# EAGLE design Escorna_Shield_botoneira_2_0D (EAGLE 6.4)
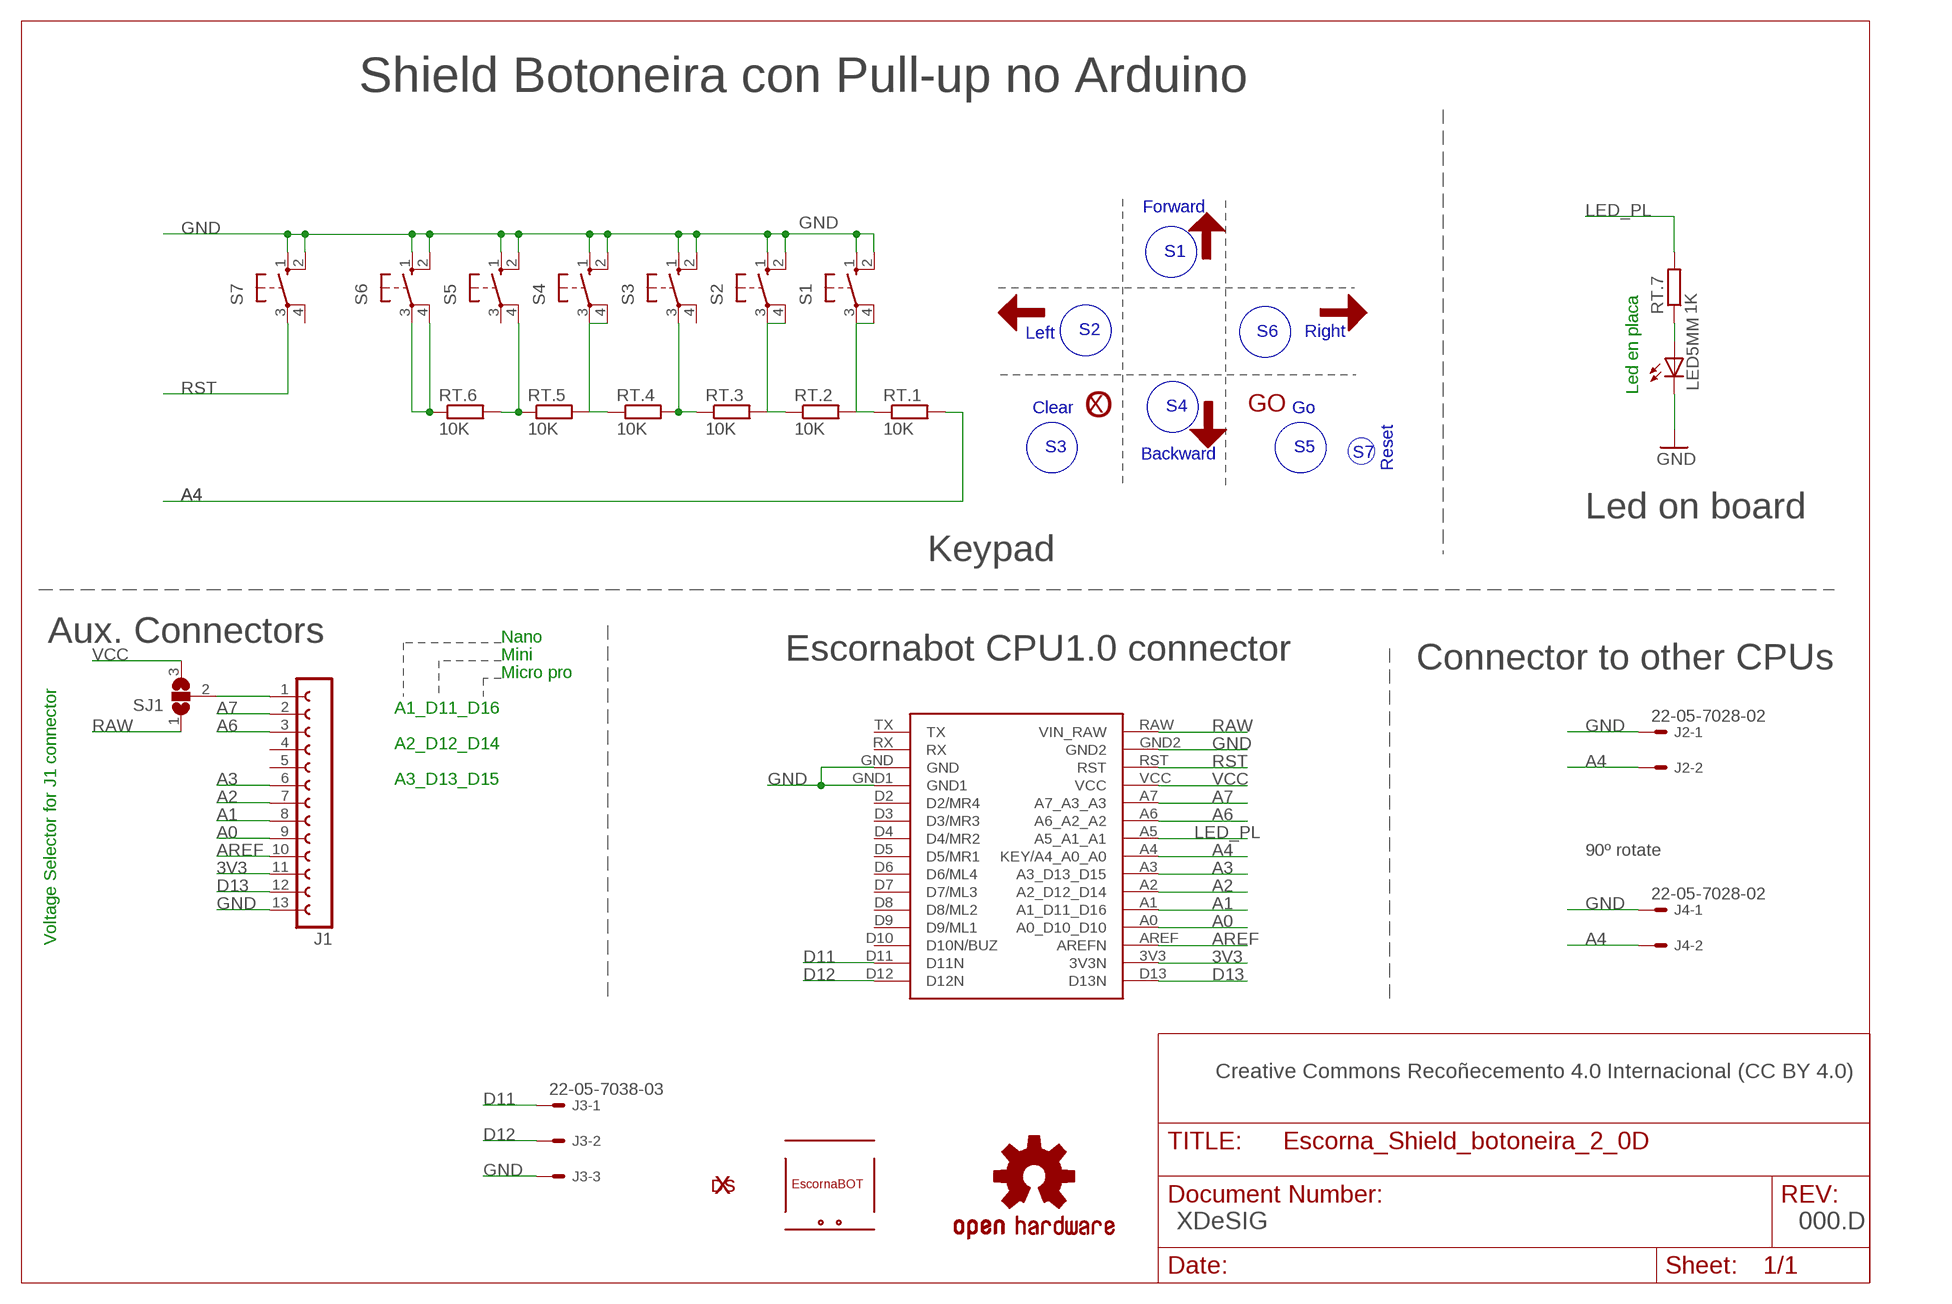
[diagram p0: schematic, sheet 1]

## Parts
ESSH1  OUTL_ESCORNASHILED  [OUTL_ESCORNASHIELD]
J1  FE13-1  [FE13]
J2  22-05-7028-02  [7395-02]
J3  22-05-7038-03  [7395-03]
J4  22-05-7028-02  [7395-02]
LED5MM  LED5MM  [LED5MM]
LOGO2  OSHW-LOGOS  [OSHW-LOGO-S]
RT.1  10K  R-EU_0204/7  [0204/7]
RT.2  10K  R-EU_0204/7  [0204/7]
RT.3  10K  R-EU_0204/7  [0204/7]
RT.4  10K  R-EU_0204/7  [0204/7]
RT.5  10K  R-EU_0204/7  [0204/7]
RT.6  10K  R-EU_0204/7  [0204/7]
RT.7  1K  R-EU_0204/7  [0204/7]
S1  B3F-40XX  40-XX  [B3F40XX_NH]
S2  B3F-40XX  40-XX  [B3F40XX_NH]
S3  B3F-40XX  40-XX  [B3F40XX_NH]
S4  B3F-40XX  40-XX  [B3F40XX_NH]
S5  B3F-40XX  40-XX  [B3F40XX_NH]
S6  B3F-40XX  40-XX  [B3F40XX_NH]
S7  10-XX  [B3F-10XX]
SJ1  SOLDERJUMPER_2WAY  [SJ_2]
U$1  ESCORNABOT  [ESCORNA_PEQUE]
U$3  XDESIG21  [XDESIG]
U$4  FRECHA  [FRECHA]
U$5  FRECHA  [FRECHA]
U$6  FRECHA  [FRECHA]
U$7  FRECHA  [FRECHA]
U$8  GO  [VALE]
U$9  CANCELA  [ASPA]
U$10  XDESIG  [XDESIG_CU_2]

## Nets
3V3: ESSH1.3V3(3V3N) J1.11
A0: ESSH1.A0(A0_D10_D10) J1.9
A1: ESSH1.A1(A1_D11_D16) J1.8
A2: ESSH1.A2(A2_D12_D14) J1.7
A3: ESSH1.A3(A3_D13_D15) J1.6
A4: ESSH1.A4(KEY/A4_A0_A0) J2.2 J4.2 RT.1.2
A6: ESSH1.A6(A6_A2_A2) J1.3
A7: ESSH1.A7(A7_A3_A3) J1.2
AREF: ESSH1.AREF(AREFN) J1.10
D11: ESSH1.D11(D11N) J3.1
D12: ESSH1.D12(D12N) J3.2
D13: ESSH1.D13(D13N) J1.12
GND: ESSH1.GND ESSH1.GND1 ESSH1.GND2 J1.13 J2.1 J3.3 J4.1 LED5MM.K(C) S1.1(S) S1.2(S1) S2.1(S) S2.2(S1) S3.1(S) S3.2(S1) S4.1(S) S4.2(S1) S5.1(S) S5.2(S1) S6.1(S) S6.2(S1) S7.1(S) S7.2(S1)
LED_PL: ESSH1.A5(A5_A1_A1) RT.7.2
N$1: LED5MM.A RT.7.1
N$2: J1.1 SJ1.2
N$3: RT.2.2 S1.4(P1)
N$4: RT.1.1 S1.3(P)
N$5: RT.5.2 S4.4(P1)
N$6: RT.6.1 S6.3(P) S6.4(P1)
N$7: RT.4.1 S4.3(P)
N$8: RT.3.1 RT.4.2 S3.3(P)
N$9: RT.2.1 S2.3(P)
N$10: RT.3.2 S2.4(P1)
N$13: RT.5.1 RT.6.2 S5.4(P1)
RAW: ESSH1.RAW(VIN_RAW) SJ1.1
RST: ESSH1.RST S7.3(P)
VCC: ESSH1.VCC SJ1.3
Unconnected: ESSH1.D2(D2/MR4) ESSH1.D3(D3/MR3) ESSH1.D4(D4/MR2) ESSH1.D5(D5/MR1) ESSH1.D6(D6/ML4) ESSH1.D7(D7/ML3) ESSH1.D8(D8/ML2) ESSH1.D9(D9/ML1) ESSH1.D10(D10N/BUZ) ESSH1.RX ESSH1.TX J1.4 J1.5 S3.4(P1) S5.3(P) S7.4(P1)

## Notes on the sheet
- Shield Botoneira con Pull-up no Arduino
- Forward
- S1
- Left | S2 | S6 | Right
- Led en placa
- Clear | S4 | Go
- S3 | S5
- Backward | S7
- Reset
- Led on board
- Keypad
- Aux. Connectors | Nano | Connector to other CPUs
- Mini | Escornabot CPU1.0 connector
- Micro pro
- A1_D11_D16
- A2_D12_D14
- A3_D13_D15
- 90º rotate
- Voltage Selector for J1 connector
- Creative Commons Recoñecemento 4.0 Internacional (CC BY 4.0)
- XDeSIG | 000.D

## Library data of the parts
ESSH1 = escorna:OUTL_ESCORNASHILED
J1 = con-lsta:FE13-1: FEMALE HEADER; OC_FARNELL: unknown; OC_NEWARK: unknown
J2 J4 = con-molex:22-?-02: CONNECTOR wire to board 2.54 mm (.1 inch) pitch header; OC_FARNELL: 9731601; OC_NEWARK: unknown
J3 = con-molex:22-?-03: CONNECTOR wire to board 2.54 mm (.1 inch) pitch header; OC_FARNELL: unknown; OC_NEWARK: unknown
LED5MM = adafruit:LED: LED OSRAM: - CHIPLED LG R971, LG N971, LY N971, LG Q971, LY Q971, LO R971, LY R971 LH N974, LH R974 LS Q976, LO Q976, LY Q976 LO Q996 - Hyper CHIPLED LW Q18S LB Q993, LB Q99A, LB R99A - SideLED LS A670, LO A670, LY A670, LG A670, LP A670 LB A673, LV A673, LT A673, LW A673 LH A674 LY A675 LS A676, LA A676, LO A676, LY A676, LW A676 LS A679, LY A679, LG A679 - Hyper Micro SIDELED® LS Y876, LA Y876, LO Y876, LY Y876 LT Y87S - SmartLED LW L88C, LW L88S LB L89C, LB L89S, LG L890 LS L89K, LO L89K, LY L89K LS L896, LA L896, LO L896, LY L896 - TOPLED LS T670, LO T670, LY T670, LG T670, LP T670 LSG T670, LSP T670, LSY T670, LOP T670, LYG T670 LG T671, LOG T671, LSG T671 LB T673, LV T673, LT T673, LW T673 LH T674 LS T676, LA T676, LO T676, LY T676, LB T676, LH T676, LSB T676, LW T676 LB T67C, LV T67C, LT T67C, LS T67K, LO T67K, LY T67K, LW E67C LS E67B, LA E67B, LO E67B, LY E67B, LB E67C, LV E67C, LT E67C LW T67C LS T679, LY T679, LG T679 LS T770, LO T770, LY T770, LG T770, LP T770 LB T773, LV T773, LT T773, LW T773 LH T774 LS E675, LA E675, LY E675, LS T675 LS T776, LA T776, LO T776, LY T776, LB T776 LHGB T686 LT T68C, LB T68C - Hyper Mini TOPLED® LB M676 - Mini TOPLED Santana® LG M470 LS M47K, LO M47K, LY M47K Source: http://www.osram.convergy.de/
LOGO2 = SparkFun-Aesthetics:OSHW-LOGO: Open Source Hardware Logo This logo indicates the piece of hardware it is found on incorporates a OSHW license and/or adheres to the definition of open source hardware found here: http://freedomdefined.org/OSHW
RT.1-RT.7 = rcl:R-EU_: RESISTOR, European symbol
S1-S6 = switch-omron:40-XX: OMRON SWITCH
S7 = switch-omron:10-XX: OMRON SWITCH; MPN: B3F-1000; OC_FARNELL: 176432; OC_NEWARK: 36M3542
SJ1 = SparkFunEagle-6-6-07:SOLDERJUMPER_2WAY: Solder Jumper 2 way solder jumper
U$1 = escorna:ESCORNABOT
U$3 U$10 = xdesig:XDESIG
U$4-U$7 = escorna:FRECHA
U$8 = escorna:GO
U$9 = escorna:CANCELA

## Board
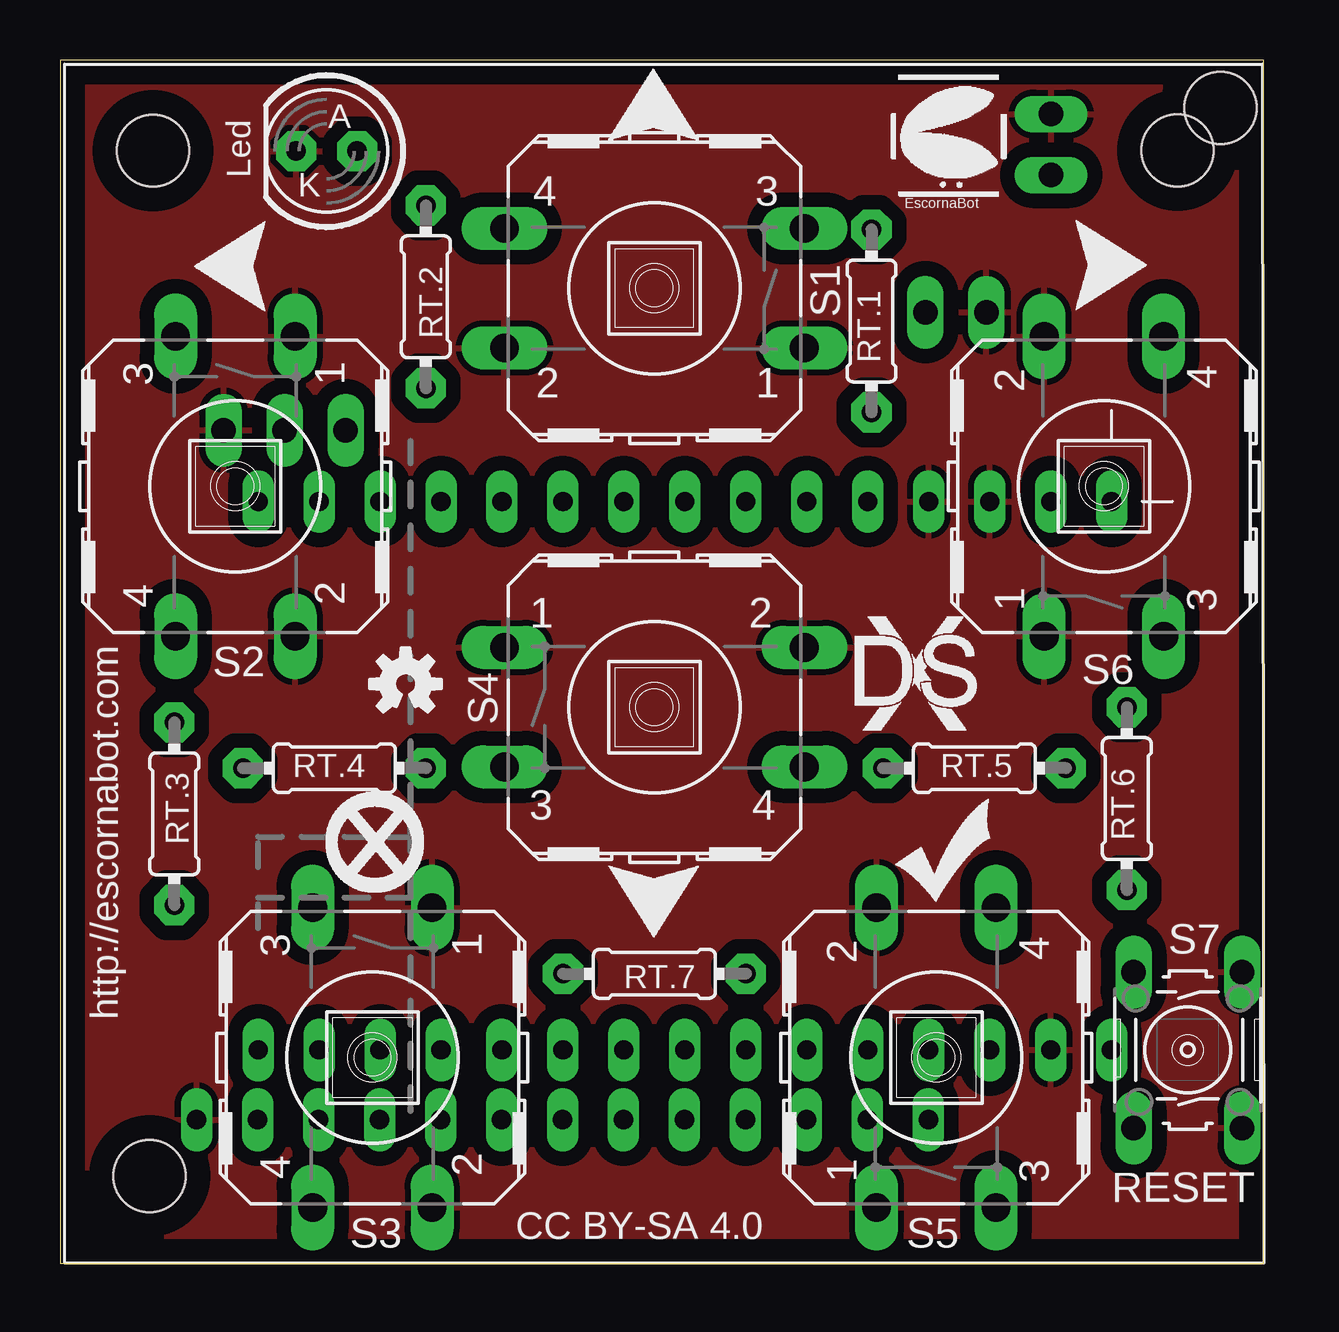
[diagram p1: board, top side]
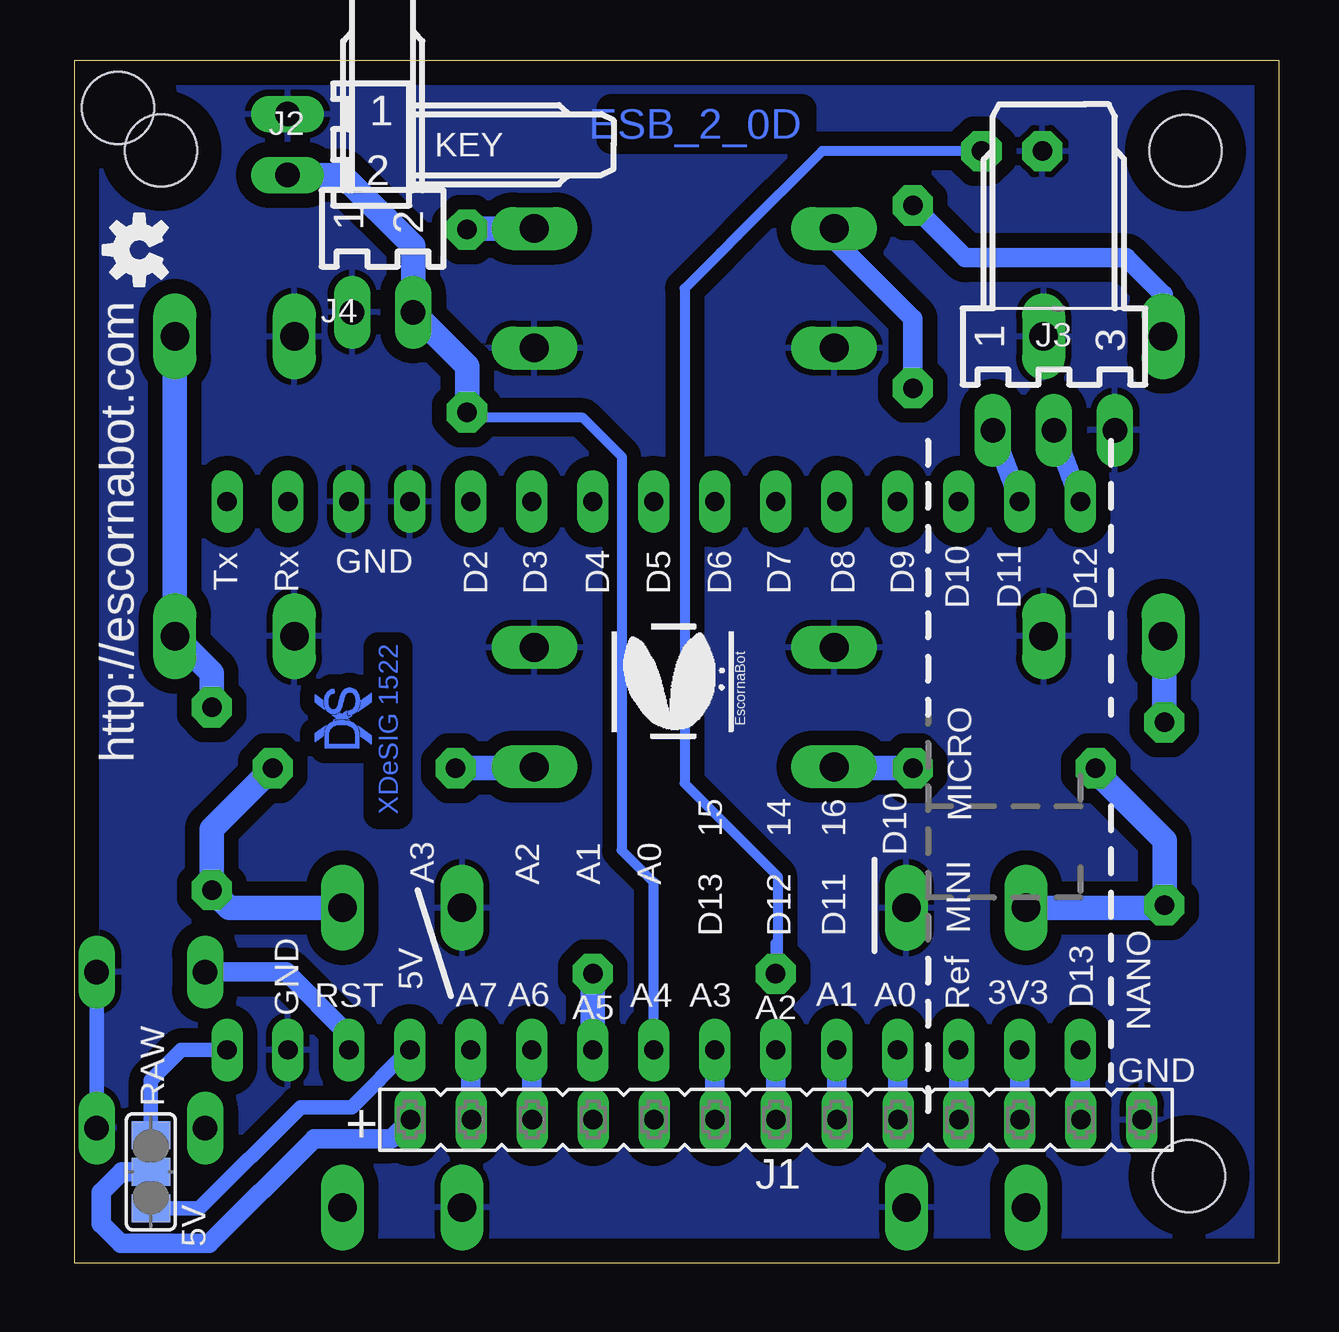
[diagram p2: board, bottom side, seen from below]

Size 50.15 x 50.16 mm. Coordinates in mm from the lower left corner, seen from the top.
Outline: 0,0 50.15,0 50.15,50.16 0,50.16 0,0
Copper layers (1*16): Top 0.035mm / dielectric 1.5mm / Bottom 0.035mm
Design rules "default": minimum track width 10mil, minimum drill 24mil, track to track 8mil, track to pad 8mil, pad to pad 8mil, via to via 8mil, smd to smd 8mil, copper to edge 40mil, drill to drill 8mil, minimum pad ring 10mil, minimum via ring 8mil, stop-mask expansion 4mil, vias tented up to drill 0mil, thermal gap 10mil
Holes 3 mm at 3.88,46.38 46.56,46.39

### Footprints (pad centres in the part's own frame; a part is rotated, then mirrored left to right if it is on the bottom)
OUTL_ESCORNASHIELD = drill 0.8 long: 3V3 -16.51,13.97; A0 -16.51,8.89; A1 -16.51,6.35; A2 -16.51,3.81; A3 -16.51,1.27; A4 -16.51,-1.27; A5 -16.51,-3.81; A6 -16.51,-6.35; A7 -16.51,-8.89; AREF -16.51,11.43; D2 6.35,-8.89; D3 6.35,-6.35; D4 6.35,-3.81; D5 6.35,-1.27; D6 6.35,1.27; D7 6.35,3.81; D8 6.35,6.35; D9 6.35,8.89; D10 6.35,11.43; D11 6.35,13.97; D12 6.35,16.51; D13 -16.51,16.51; GND 6.35,-13.97; GND1 6.35,-11.43; GND2 -16.51,-16.51; RAW -16.51,-19.05; RST -16.51,-13.97; RX 6.35,-16.51; TX 6.35,-19.05; VCC -16.51,-11.43 | hole 3: 22.76,-23.585; -21.76,21.03
FE13 = drill 0.813 long: 1 -15.24,0; 2 -12.7,0; 3 -10.16,0; 4 -7.62,0; 5 -5.08,0; 6 -2.54,0; 7 0,0; 8 2.54,0; 9 5.08,0; 10 7.62,0; 11 10.16,0; 12 12.7,0; 13 15.24,0
7395-02 = drill 1.016 long: 1 1.27,0; 2 -1.27,0
7395-03 = drill 1.016 long: 1 2.54,0; 2 0,0; 3 -2.54,0
LED5MM = drill 0.813 pad 1.676 octagon: A -1.27,0; K 1.27,0
0204/7 = drill 0.813 pad 1.676 octagon: 1 -3.81,0; 2 3.81,0
B3F40XX_NH = drill 1.194 long: 1 -6.248,2.489; 2 6.248,2.489; 3 -6.248,-2.489; 4 6.248,-2.489
B3F-10XX = drill 1.016 long: 1 -3.251,2.261; 2 3.251,2.261; 3 -3.251,-2.261; 4 3.251,-2.261
SJ_2 = smd 1.168 x 1.6: 1 -1.524,0; 2 0,0; 3 1.524,0

### Placement (x,y rotation side)
ESSH1  24.77,25.4 90 top
J1  20.94,5.98 0 bottom
J2  41.3,46.63 90 bottom
J3  9.36,34.72 180 bottom
J4  37.33,39.64 180 bottom
LED5MM  11.11,46.35 180 top
LOGO1  OSHW-LOGOS  [OSHW-LOGO-S]  14.4,24.15 0 top
LOGO2  47.48,42.24 90 bottom
RT.1  33.81,39.28 270 top
RT.2  15.24,40.28 270 top
RT.3  4.76,18.73 90 top
RT.4  11.43,20.64 180 top
RT.5  38.1,20.64 180 top
RT.6  44.45,19.37 270 top
RT.7  24.77,12.06 0 top
S1  24.77,40.64 180 top
S2  7.3,32.38 270 top
S3  13.02,8.57 270 top
S4  24.77,23.18 0 top
S5  36.51,8.57 90 top
S6  43.5,32.38 90 top
S7  46.99,8.89 270 top
SJ1  46.99,3.81 270 bottom
U$1  22.64,21.78 90 bottom
U$2  ESCORNABOT  [ESCORNA_PEQUE]  34.56,44.39 0 top
U$3  33.13,22.21 0 top
U$4  42.27,39.68 0 top
U$5  8.6,43.48 180 top
U$6  26.64,46.78 90 top
U$7  22.82,16.59 270 top
U$8  34.77,15.03 0 top
U$9  11.05,15.44 0 top
U$10  37.78,21.46 90 bottom

### Tracks (layer width: path | path; a pad name or v marks a point on that pad's centre or on a via)
3V3
  Bottom 0.813: ESSH1.3V3 10.79,6 J1.11
A0
  Bottom 0.813: ESSH1.A0 15.88,6 J1.9
A1
  Bottom 0.813: ESSH1.A1 18.41,6 J1.8
A2
  Bottom 0.813: ESSH1.A2 20.95,6 J1.7
A3
  Bottom 0.813: ESSH1.A3 23.5,6 J1.6
A4
  Bottom 0.406: ESSH1.A4 26.04,15.88 27.38,17.21 27.38,33.62 28.99,35.24 33.59,35.24 RT.1.2
  Bottom 1.016: J2.2 39.01,45.36 36.06,42.41 J4.2 33.81,37.39 RT.1.2
A6
  Bottom 0.813: ESSH1.A6 31.11,6 J1.3
A7
  Bottom 0.813: ESSH1.A7 33.66,6 J1.2
AREF
  Bottom 0.813: ESSH1.AREF 13.34,6 J1.10
D11  (via drill 0.6)
  Bottom 0.813: v10.78,31.77 ESSH1.D11 J3.1
D12  (via drill 0.6)
  Bottom 0.813: v8.23,31.77 ESSH1.D12 J3.2
D13
  Bottom 0.813: ESSH1.D13 8.26,6 J1.12
GND
  Bottom 0.61: S7.1 S7.2
  pour Bottom (isolate 0.61): 0,50.8 50.8,50.8 50.8,0 0,0
  pour Top (isolate 0.61): 0,49.53 0,50.8 50.8,50.8 50.8,0 0,0
LED_PL
  Bottom 1.016: RT.7.2 ESSH1.A5
N$1
  Bottom 0.406: 20.95,13.34 RT.7.1 20.88,12.14 20.88,16.12 24.75,20 24.75,40.62 23.25,42.12 22.53,42.85 19.02,46.35 LED5MM.A
N$2
  Bottom 0.813: SJ1.2 48.2,3.81 49.06,2.95 49.06,1.65 48.24,0.82 44.55,0.82 40.19,5.19 36.97,5.19 J1.1
N$3
  Bottom 0.813: S1.4 18.52,42.65 15.24,39.37 RT.2.2
N$4
  Bottom 1.016: S1.3 33.62,43.13 RT.1.1
N$5
  Bottom 1.016: RT.5.2 31.06,20.64 S4.4
N$6
  Bottom 1.016: S6.4 S6.3 44.45,24.6 RT.6.1
N$7
  Bottom 1.016: RT.4.1 18.47,20.64 S4.3
N$8
  Bottom 1.016: RT.4.2 7.62,20.5 4.75,17.62 4.75,14.94 RT.3.1 4.86,14.82 S3.3
N$9
  Bottom 0.813: S2.3 4.81,40.37 6.35,41.91 13.05,41.91 RT.2.1
N$10
  Bottom 1.016: RT.3.2 4.76,26.09 S2.4
N$13
  Bottom 1.016: S5.4 43.71,14.82 RT.6.2 44.45,18.1 RT.5.1
RAW
  Bottom 0.61: SJ1.1 46.99,7.62 45.72,8.89 ESSH1.RAW
RST
  Bottom 0.813: S7.3 41.35,12.14 38.73,9.53 ESSH1.RST
VCC
  Bottom 0.61: SJ1.3 44.96,2.29 40.75,6.5 38.62,6.5 36.23,8.89 ESSH1.VCC

### Text on the board
Bottom: ESB_2_0D | XDeSIG 1522
tPlace: A | Led | K | http://escornabot.com | RESET | CC BY-SA 4.0
bPlace: KEY | http://escornabot.com | D12 | D11 | D10 | D9 | D8 | D7 | D6 | D5 | D4 | D3 | D2 | GND | Rx | Tx | D10 | 16 | 14 | 15 | MICRO | A0 | A1 | A2 | A3 | D11 | D12 | D13 | NANO | MINI | GND | 5V | 3V3 | A0 | A1 | A3 | A4 | A6 | A7 | RST | D13 | Ref | A2 | A5 | GND | + | RAW | 5V
Document: Creative Commons Attribution-ShareAlike 4.0 International (CC BY-SA 4.0)